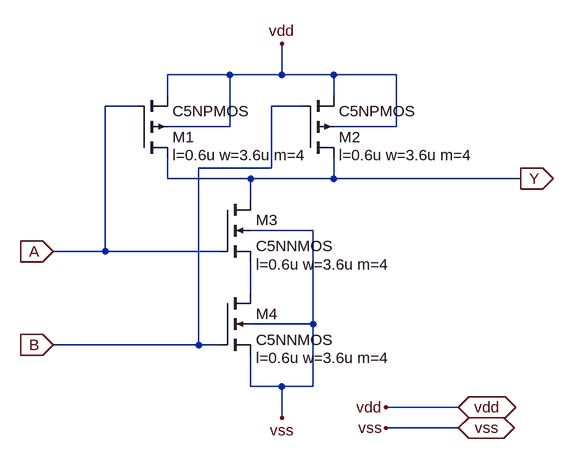
[diagram p0: schematic nand2_4x.asc]
nand2_4x.asc, the LTspice schematic file:
Version 4
SHEET 1 880 680
WIRE -336 -64 -432 -64
WIRE -256 -64 -256 -112
WIRE -256 -64 -336 -64
WIRE -176 -64 -256 -64
WIRE -80 -64 -176 -64
WIRE -432 -32 -432 -64
WIRE -176 -32 -176 -64
WIRE -480 -16 -528 -16
WIRE -224 -16 -272 -16
WIRE -336 16 -336 -64
WIRE -336 16 -432 16
WIRE -80 16 -80 -64
WIRE -80 16 -176 16
WIRE -272 80 -272 -16
WIRE -272 80 -384 80
WIRE -432 96 -432 64
WIRE -304 96 -432 96
WIRE -176 96 -176 64
WIRE -176 96 -304 96
WIRE 112 96 -176 96
WIRE -304 128 -304 96
WIRE -208 176 -304 176
WIRE -528 208 -528 -16
WIRE -528 208 -608 208
WIRE -352 208 -528 208
WIRE -304 272 -304 224
WIRE -208 320 -208 176
WIRE -208 320 -304 320
WIRE -384 352 -384 80
WIRE -384 352 -608 352
WIRE -352 352 -384 352
WIRE -304 416 -304 368
WIRE -256 416 -304 416
WIRE -208 416 -208 320
WIRE -208 416 -256 416
WIRE 16 448 -96 448
WIRE -256 464 -256 416
WIRE 16 480 -96 480
FLAG -608 208 A
IOPIN -608 208 In
FLAG 112 96 Y
IOPIN 112 96 Out
FLAG -608 352 B
IOPIN -608 352 In
FLAG 16 448 vdd
IOPIN 16 448 BiDir
FLAG 16 480 vss
IOPIN 16 480 BiDir
FLAG -96 448 vdd
FLAG -96 480 vss
FLAG -256 -112 vdd
FLAG -256 464 vss
SYMBOL pmos4 -480 64 M180
WINDOW 123 56 4 Left 2
SYMATTR Value2 l=0.6u w=3.6u m=4
SYMATTR InstName M1
SYMATTR Value C5NPMOS
SYMBOL pmos4 -224 64 M180
WINDOW 123 56 4 Left 2
SYMATTR Value2 l=0.6u w=3.6u m=4
SYMATTR InstName M2
SYMATTR Value C5NPMOS
SYMBOL nmos4 -352 128 R0
WINDOW 123 56 100 Left 2
SYMATTR Value2 l=0.6u w=3.6u m=4
SYMATTR InstName M3
SYMATTR Value C5NNMOS
SYMBOL nmos4 -352 272 R0
WINDOW 123 56 100 Left 2
SYMATTR Value2 l=0.6u w=3.6u m=4
SYMATTR InstName M4
SYMATTR Value C5NNMOS

The netlist it stands for:
* nand2_4x.asc
M1 Y A vdd vdd C5NPMOS l=0.6u w=3.6u m=4
M2 Y B vdd vdd C5NPMOS l=0.6u w=3.6u m=4
M3 Y A N001 vss C5NNMOS l=0.6u w=3.6u m=4
M4 N001 B vss vss C5NNMOS l=0.6u w=3.6u m=4
.model NMOS NMOS
.model PMOS PMOS
.lib standard.mos
.backanno
.end